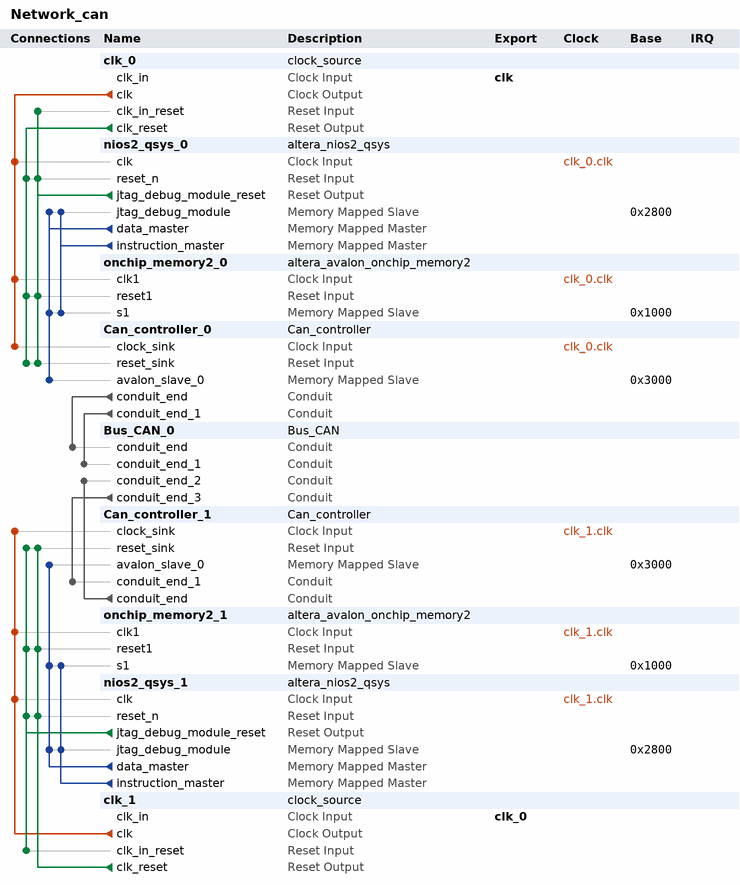
[diagram p0: system contents]
# Platform Designer (Qsys) system Network_can, Cyclone III EP3C25F324C6
# Parameters at their usual value, and those the tool derives, are not listed.
package require -exact qsys 13.1
create_system Network_can
set_project_property DEVICE_FAMILY {Cyclone III}
set_project_property DEVICE EP3C25F324C6

add_instance clk_0 clock_source 13.1
set_instance_parameter_value clk_0 clockFrequency 50000000

add_instance nios2_qsys_0 altera_nios2_qsys 13.1
set_instance_parameter_value nios2_qsys_0 resetSlave onchip_memory2_0.s1
set_instance_parameter_value nios2_qsys_0 mmu_TLBMissExcSlave None
set_instance_parameter_value nios2_qsys_0 exceptionSlave onchip_memory2_0.s1
set_instance_parameter_value nios2_qsys_0 breakSlave nios2_qsys_0.jtag_debug_module
set_instance_parameter_value nios2_qsys_0 impl Tiny
set_instance_parameter_value nios2_qsys_0 icache_size 4096

add_instance onchip_memory2_0 altera_avalon_onchip_memory2 13.1
set_instance_parameter_value onchip_memory2_0 dataWidth 16
set_instance_parameter_value onchip_memory2_0 dualPort false
set_instance_parameter_value onchip_memory2_0 initMemContent true
set_instance_parameter_value onchip_memory2_0 initializationFileName onchip_mem.hex
set_instance_parameter_value onchip_memory2_0 memorySize 4096

add_instance Can_controller_0 Can_controller 1.0

add_instance Bus_CAN_0 Bus_CAN 1.0

add_instance Can_controller_1 Can_controller 1.0

add_instance onchip_memory2_1 altera_avalon_onchip_memory2 13.1
set_instance_parameter_value onchip_memory2_1 dataWidth 16
set_instance_parameter_value onchip_memory2_1 dualPort false
set_instance_parameter_value onchip_memory2_1 initMemContent true
set_instance_parameter_value onchip_memory2_1 initializationFileName onchip_mem.hex
set_instance_parameter_value onchip_memory2_1 memorySize 4096

add_instance nios2_qsys_1 altera_nios2_qsys 13.1
set_instance_parameter_value nios2_qsys_1 resetSlave onchip_memory2_1.s1
set_instance_parameter_value nios2_qsys_1 mmu_TLBMissExcSlave None
set_instance_parameter_value nios2_qsys_1 exceptionSlave onchip_memory2_1.s1
set_instance_parameter_value nios2_qsys_1 breakSlave nios2_qsys_1.jtag_debug_module
set_instance_parameter_value nios2_qsys_1 impl Tiny
set_instance_parameter_value nios2_qsys_1 icache_size 4096

add_instance clk_1 clock_source 13.1
set_instance_parameter_value clk_1 clockFrequency 50000000

# connections
add_connection clk_0.clk Can_controller_0.clock_sink clock
add_connection clk_0.clk nios2_qsys_0.clk clock
add_connection clk_0.clk onchip_memory2_0.clk1 clock
add_connection clk_1.clk Can_controller_1.clock_sink clock
add_connection clk_1.clk nios2_qsys_1.clk clock
add_connection clk_1.clk onchip_memory2_1.clk1 clock
add_connection clk_0.clk_reset Can_controller_0.reset_sink reset
add_connection clk_0.clk_reset nios2_qsys_0.reset_n reset
add_connection clk_0.clk_reset onchip_memory2_0.reset1 reset
add_connection clk_1.clk_reset Can_controller_1.reset_sink reset
add_connection clk_1.clk_reset nios2_qsys_1.reset_n reset
add_connection clk_1.clk_reset onchip_memory2_1.reset1 reset
add_connection nios2_qsys_0.jtag_debug_module_reset Can_controller_0.reset_sink reset
add_connection nios2_qsys_0.jtag_debug_module_reset clk_0.clk_in_reset reset
add_connection nios2_qsys_0.jtag_debug_module_reset nios2_qsys_0.reset_n reset
add_connection nios2_qsys_0.jtag_debug_module_reset onchip_memory2_0.reset1 reset
add_connection nios2_qsys_1.jtag_debug_module_reset Can_controller_1.reset_sink reset
add_connection nios2_qsys_1.jtag_debug_module_reset clk_1.clk_in_reset reset
add_connection nios2_qsys_1.jtag_debug_module_reset nios2_qsys_1.reset_n reset
add_connection nios2_qsys_1.jtag_debug_module_reset onchip_memory2_1.reset1 reset
add_connection nios2_qsys_0.data_master Can_controller_0.avalon_slave_0 avalon
set_connection_parameter_value nios2_qsys_0.data_master/Can_controller_0.avalon_slave_0 baseAddress 0x3000
add_connection nios2_qsys_0.data_master nios2_qsys_0.jtag_debug_module avalon
set_connection_parameter_value nios2_qsys_0.data_master/nios2_qsys_0.jtag_debug_module baseAddress 0x2800
add_connection nios2_qsys_0.data_master onchip_memory2_0.s1 avalon
set_connection_parameter_value nios2_qsys_0.data_master/onchip_memory2_0.s1 baseAddress 0x1000
add_connection nios2_qsys_0.instruction_master nios2_qsys_0.jtag_debug_module avalon
set_connection_parameter_value nios2_qsys_0.instruction_master/nios2_qsys_0.jtag_debug_module baseAddress 0x2800
add_connection nios2_qsys_0.instruction_master onchip_memory2_0.s1 avalon
set_connection_parameter_value nios2_qsys_0.instruction_master/onchip_memory2_0.s1 baseAddress 0x1000
add_connection nios2_qsys_1.data_master Can_controller_1.avalon_slave_0 avalon
set_connection_parameter_value nios2_qsys_1.data_master/Can_controller_1.avalon_slave_0 baseAddress 0x3000
add_connection nios2_qsys_1.data_master nios2_qsys_1.jtag_debug_module avalon
set_connection_parameter_value nios2_qsys_1.data_master/nios2_qsys_1.jtag_debug_module baseAddress 0x2800
add_connection nios2_qsys_1.data_master onchip_memory2_1.s1 avalon
set_connection_parameter_value nios2_qsys_1.data_master/onchip_memory2_1.s1 baseAddress 0x1000
add_connection nios2_qsys_1.instruction_master nios2_qsys_1.jtag_debug_module avalon
set_connection_parameter_value nios2_qsys_1.instruction_master/nios2_qsys_1.jtag_debug_module baseAddress 0x2800
add_connection nios2_qsys_1.instruction_master onchip_memory2_1.s1 avalon
set_connection_parameter_value nios2_qsys_1.instruction_master/onchip_memory2_1.s1 baseAddress 0x1000
add_connection Bus_CAN_0.conduit_end_3 Can_controller_1.conduit_end_1 conduit
add_connection Can_controller_0.conduit_end Bus_CAN_0.conduit_end conduit
add_connection Can_controller_0.conduit_end_1 Bus_CAN_0.conduit_end_1 conduit
add_connection Can_controller_1.conduit_end Bus_CAN_0.conduit_end_2 conduit

# exported interfaces
add_interface clk_0 clock sink
set_interface_property clk_0 EXPORT_OF clk_1.clk_in
add_interface clk clock sink
set_interface_property clk EXPORT_OF clk_0.clk_in

set_interconnect_requirement {$system} qsys_mm.clockCrossingAdapter HANDSHAKE
set_interconnect_requirement {$system} qsys_mm.maxAdditionalLatency 1
set_interconnect_requirement {$system} qsys_mm.insertDefaultSlave false

save_system Network_can.qsys
